# EAGLE schematic untitled (EAGLE 6.2)
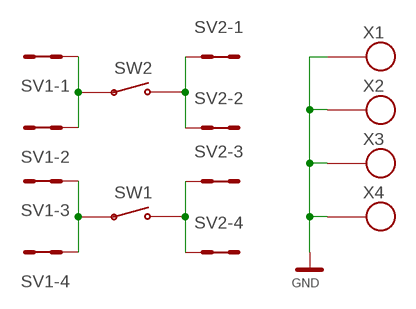
[diagram p0: schematic, sheet 1]

## Parts
SV1  MA04-2  [MA04-2]
SV2  MA04-2  [MA04-2]
SW1  TACT-64K  [TACT-64K]
SW2  TACT-64K  [TACT-64K]
X1  SROUB3M  [SROUB3M]
X2  SROUB3M  [SROUB3M]
X3  SROUB3M  [SROUB3M]
X4  SROUB3M  [SROUB3M]

## Nets
GND: X1.P$1 X2.P$1 X3.P$1 X4.P$1
N$1: SV1.5 SV1.6 SV1.7 SV1.8 SW1.P$1 SW1.P$2
N$2: SV2.5 SV2.6 SV2.7 SV2.8 SW1.P$3 SW1.P$4
N$3: SV1.1 SV1.2 SV1.3 SV1.4 SW2.P$1 SW2.P$2
N$4: SV2.1 SV2.2 SV2.3 SV2.4 SW2.P$3 SW2.P$4

## Library data of the parts
SV1 SV2 = moje_hrebinky:MA04-2: PIN HEADER; OC_FARNELL: unknown; OC_NEWARK: unknown
SW1 SW2 = moje_tlacitka:TACT-64K: Resetovací tlačítko TACT-64K
X1-X4 = moje:SROUB3M